# Altium schematic sheet Safety Loops.SchDoc
size A4
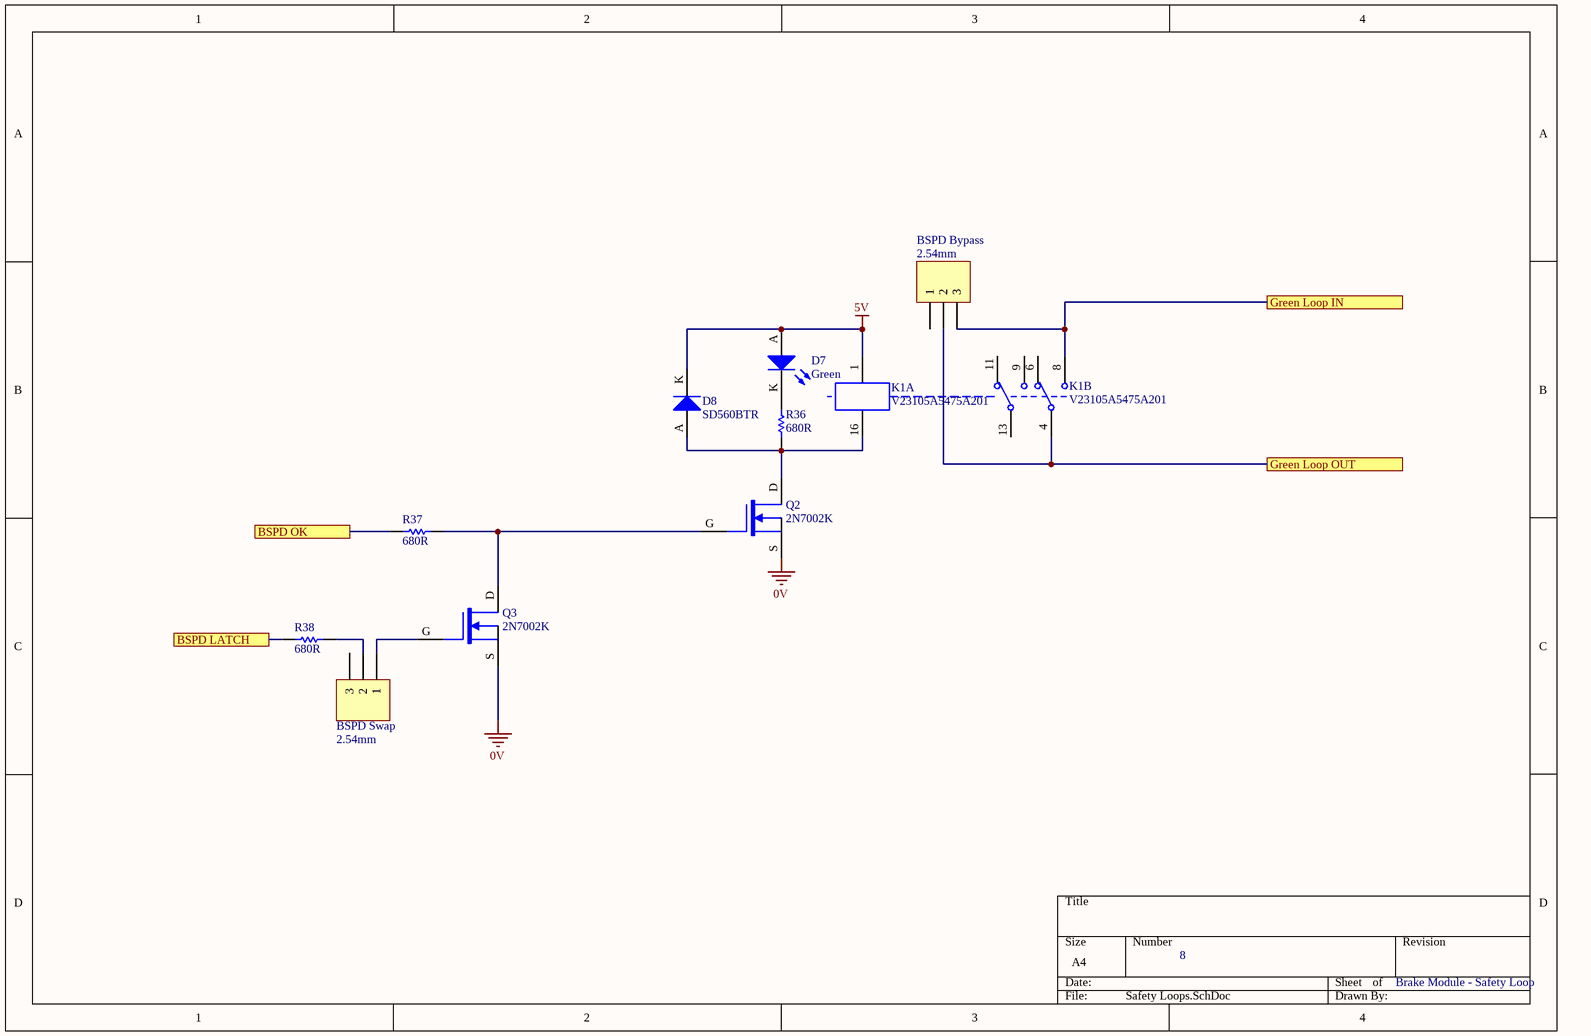
[diagram p0: Safety Loops.SchDoc]

## Parts
BSPD_Bypass  2.54mm  [TH 2.54mm Header 1x3]
BSPD_Swap  2.54mm  [TH 2.54mm Header 1x3]
D7  Green  [0805 LED]
D8  SD560BTR  [SMB Diode]
K1  V23105A5475A201  [TI 2-DIL]  (parts A,B of 2)
Q2  2N7002K  [ON SOT-23 MOSFET]
Q3  2N7002K  [ON SOT-23 MOSFET]
R36  680R  [R0603]
R37  680R  [R0603]
R38  680R  [R0603]

## Ports
BSPD LATCH, BSPD OK, Green Loop IN, Green Loop OUT

## Nets
0V: Q2.S Q3.S
5V: D7.A D8.K K1.1
BSPD LATCH: R38.1 ; port BSPD LATCH
BSPD OK: R37.1 ; port BSPD OK
Green Loop IN: BSPD_Bypass.3 K1.8 ; port Green Loop IN
Green Loop OUT: BSPD_Bypass.2 K1.4 ; port Green Loop OUT
NetBSPD_Swap_1: BSPD_Swap.1 Q3.G
NetBSPD_Swap_2: BSPD_Swap.2 R38.2
NetD7_K: D7.K R36.2
NetD8_A: D8.A K1.16 Q2.D R36.1
NetQ2_G: Q2.G Q3.D R37.2

Not connected (* = marked no-connect by the designer): BSPD_Bypass 1; BSPD_Swap 3; K1 6 9 11 13

## Notes on the sheet
- 8
- Brake Module - Safety Loop

## Library data of the parts
BSPD_Bypass BSPD_Swap = TH 2.54mm Header 1x3: Positions: 3; Angle: 0; Flange: No; Contact: NA; Part Number: TH 2.54mm Header 1x3; Pitch: 2.54mm; Row Spacing: 2.54mm
D7 = SML-210FTT86: Green LED Indication - Discrete 1.75V 0805 (2012 Metric); Manufacturer: ROHM Semiconductor; Part Number: SML-210FTT86; Colour: Green; Digikey Part Number: 511-1285-1-ND; Digikey Link: https://www.digikey.com/product-detail/en/rohm-semiconductor/SML-210FTT86/511-1285-1-ND/637098
D8 = SD560BTR: 1.2V_F 600V 5A SMB; Manufacturer: SMC Diode Solutions; Part Number: SD560BTR; Digikey Part Number: 1655-1530-2-ND; Digikey Link: https://www.digikey.com/product-detail/en/smc-diode-solutions/SD560BTR/1655-1530-2-ND/6022620
K1 = V23105A5475A201: 5V DPDT Relay 3A 220VDC; Manufacturer: Axicom; Part Number: V23105A5475A201; Digikey Part Number: PB383-ND; Digikey Link: https://www.digikey.com/products/en?mpart=V23105A5001A201&v=41
Q2 Q3 = 2N7002K: 60V 380mA, NFET MOSTFET (Small Signal); Manufacturer: ON Semiconductor; Published: 24-Mar-1999; LatestRevisionDate: 29-May-2009; LatestRevisionNote: IPC-7351 Footprint Added.; PackageVersion: Sep-2000; PackageReference: SOT-343; Publisher: Altium Limited; PackageDescription: 4-Pin SOT-343 Package 1.3 mm Pitch, 2.1 mm Lead Span; Part Number: 2N7002K; Digikey Part Number: 2N7002KCT-ND; Digikey Link: https://www.digikey.com/product-detail/en/on-semiconductor/2N7002K/2N7002KCT-ND/2060375; Qty: 30
R36-R38 = RCP0603B680RGEA: Tolerance: 2%; Part Number: RCP0603B680RGEA; Value: 680R; Material: Thick Film; Digikey Link: #https://www.digikey.com.au/en/products/detail/vishay-dale/RCP0603B680RGEA/5791729#